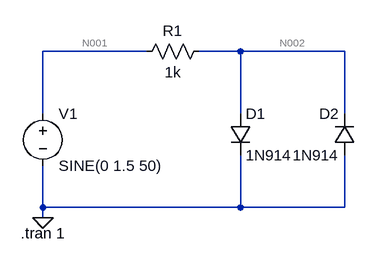
[diagram p0: schematic Draft1.asc]
Draft1.asc, the LTspice schematic file:
Version 4
SHEET 1 880 680
WIRE 176 80 16 80
WIRE 320 80 256 80
WIRE 480 80 320 80
WIRE 16 176 16 80
WIRE 320 176 320 80
WIRE 480 176 480 80
WIRE 16 320 16 256
WIRE 320 320 320 240
WIRE 320 320 16 320
WIRE 480 320 480 240
WIRE 480 320 320 320
WIRE 16 336 16 320
FLAG 16 336 0
SYMBOL voltage 16 160 R0
WINDOW 123 0 0 Left 2
WINDOW 39 0 0 Left 2
SYMATTR InstName V1
SYMATTR Value SINE(0 1.5 50)
SYMBOL res 272 64 R90
WINDOW 0 0 56 VBottom 2
WINDOW 3 32 56 VTop 2
SYMATTR InstName R1
SYMATTR Value 1k
SYMBOL diode 304 176 R0
SYMATTR InstName D1
SYMATTR Value 1N914
SYMBOL diode 496 240 R180
WINDOW 0 24 64 Left 2
WINDOW 3 24 0 Left 2
SYMATTR InstName D2
SYMATTR Value 1N914
TEXT -18 360 Left 2 !.tran 1

The netlist it stands for:
* Draft1.asc
V1 N001 0 SINE(0 1.5 50)
R1 N002 N001 1k
D1 N002 0 1N914
D2 0 N002 1N914
.model D D
.lib standard.dio
.tran 1
.backanno
.end

* Results of the author's LTspice run, read from the files saved beside the schematic
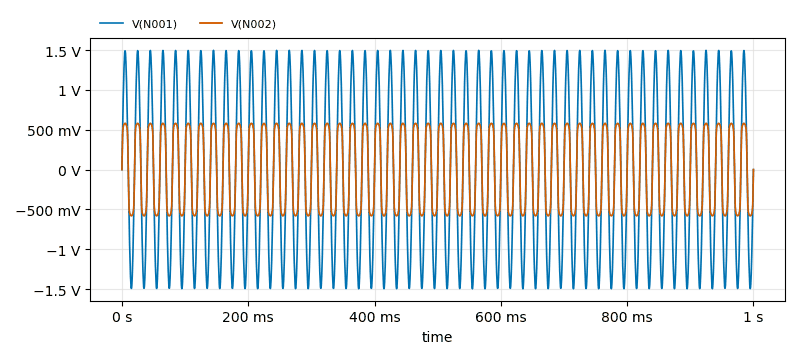
[diagram p1: Transient Analysis of Draft1.asc, plotted from the saved traces]
* Transient Analysis, 1 run:
*   V(N001): min -1.496 V, max 1.496 V, average 41.02 µV, rms 1.048 V, last 0 V
*   V(N002): min -580.7 mV, max 580.7 mV, average 23.23 µV, rms 503.7 mV, last -1.657 µV